# EAGLE schematic boost_regulator (EAGLE 6.4)
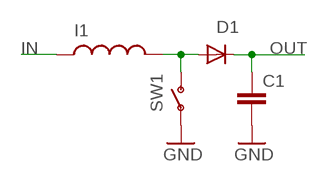
[diagram p0: schematic, sheet 1]

## Parts
C1  CAP0402-CAP  [0402-CAP]
D1  DIODE1N4148  [DIODE-1N4148]
I1  INDUCTOR  [BOURNES_E12]
SW1  SWITCH_SPST  [SPST_SMT_19192]

## Nets
GND: C1.2 SW1.B(P)
IN: I1.P$1
N$2: D1.A I1.P$2 SW1.C(S)
OUT: C1.1 D1.C

## Library data of the parts
C1 = SparkFun-Passives:CAP: Capacitor Standard 0603 ceramic capacitor, and 0.1" leaded capacitor.
D1 = SparkFun-DiscreteSemi:DIODE: Diode These are standard reverse protection diodes and small signal diodes. SMA package can handle up to about 1A. SOD-323 can handle about 200mA. What the SOD-323 package when ordering, there are some mfgs out there that are 5-pin packages.
I1 = Ava:INDUCTOR
SW1 = microbuilder:SWITCH_SPST: Switch - SPST 4UCon 19192 (6.7x2.6mm SMT)